# Altium schematic sheet Buttons.SchDoc
size 420 x 297 mm; SheetNumber: 4; SheetTotal: 4
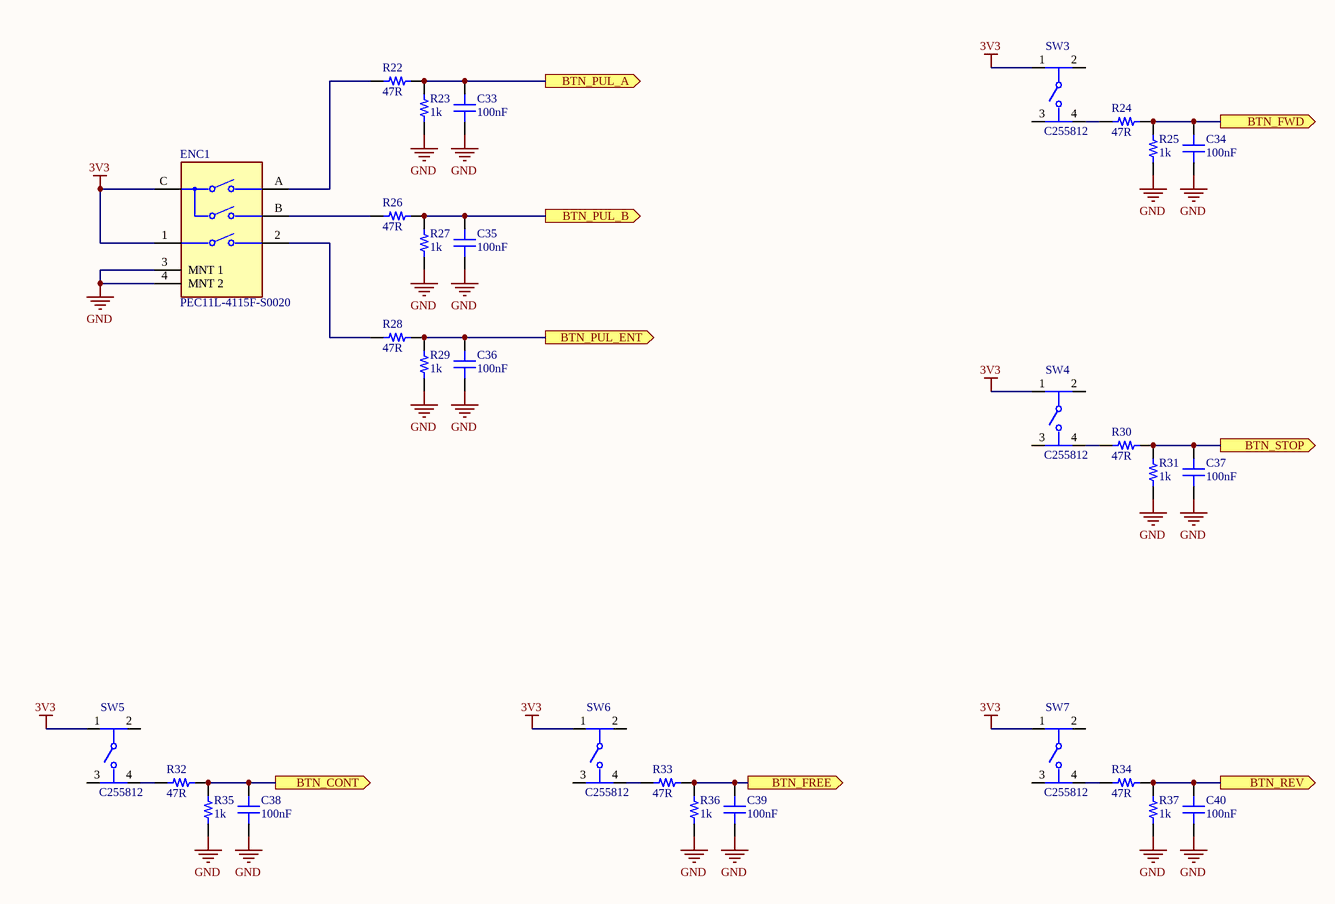
[diagram p0: Buttons.SchDoc]

## Parts
C33  100nF  [CAP 0603_1608]
C34  100nF  [CAP 0603_1608]
C35  100nF  [CAP 0603_1608]
C36  100nF  [CAP 0603_1608]
C37  100nF  [CAP 0603_1608]
C38  100nF  [CAP 0603_1608]
C39  100nF  [CAP 0603_1608]
C40  100nF  [CAP 0603_1608]
ENC1  PEC11L-4115F-S0020  [FP-PEC11L-4115F-S0020-MFG]
R22  47R  [RES 0603_1608]
R23  1k  [RES 0603_1608]
R24  47R  [RES 0603_1608]
R25  1k  [RES 0603_1608]
R26  47R  [RES 0603_1608]
R27  1k  [RES 0603_1608]
R28  47R  [RES 0603_1608]
R29  1k  [RES 0603_1608]
R30  47R  [RES 0603_1608]
R31  1k  [RES 0603_1608]
R32  47R  [RES 0603_1608]
R33  47R  [RES 0603_1608]
R34  47R  [RES 0603_1608]
R35  1k  [RES 0603_1608]
R36  1k  [RES 0603_1608]
R37  1k  [RES 0603_1608]
SW3  C255812  [FP-FSM2JSMAA-MFG]
SW4  C255812  [FP-FSM2JSMAA-MFG]
SW5  C255812  [FP-FSM2JSMAA-MFG]
SW6  C255812  [FP-FSM2JSMAA-MFG]
SW7  C255812  [FP-FSM2JSMAA-MFG]

## Ports
BTN_CONT (out, see ESP32[3A]), BTN_FREE (out, see ESP32[3A]), BTN_FWD (out, see ESP32[3A]), BTN_PUL_A (out, see ESP32[3A]), BTN_PUL_B (out, see ESP32[3A]), BTN_PUL_ENT (out, see ESP32[3A]), BTN_REV (out, see ESP32[3A]), BTN_STOP (out, see ESP32[3A])

## Nets
3V3: ENC1.1 ENC1.C(COMMON) SW3.1 SW4.1 SW5.1 SW6.1 SW7.1
GND: C33.2 C34.2 C35.2 C36.2 C37.2 C38.2 C39.2 C40.2 ENC1.3(MNT_1) ENC1.4(MNT_2) R23.2 R25.2 R27.2 R29.2 R31.2 R35.2 R36.2 R37.2
BTN_CONT: C38.1 R32.2 R35.1 ; port BTN_CONT
BTN_FREE: C39.1 R33.2 R36.1 ; port BTN_FREE
BTN_FWD: C34.1 R24.2 R25.1 ; port BTN_FWD
BTN_PUL_A: C33.1 R22.2 R23.1 ; port BTN_PUL_A
BTN_PUL_B: C35.1 R26.2 R27.1 ; port BTN_PUL_B
BTN_PUL_ENT: C36.1 R28.2 R29.1 ; port BTN_PUL_ENT
BTN_REV: C40.1 R34.2 R37.1 ; port BTN_REV
BTN_STOP: C37.1 R30.2 R31.1 ; port BTN_STOP
NetENC1_2: ENC1.2 R28.1
NetENC1_A: ENC1.A(CHANNEL_A) R22.1
NetENC1_B: ENC1.B(CHANNEL_B) R26.1
NetR24_1: R24.1 SW3.4
NetR30_1: R30.1 SW4.4
NetR32_1: R32.1 SW5.4
NetR33_1: R33.1 SW6.4
NetR34_1: R34.1 SW7.4

Not connected (* = marked no-connect by the designer): SW3 2 3; SW4 2 3; SW5 2 3; SW6 2 3; SW7 2 3

## Notes on the sheet
- This document and the data disclosed herein or herewith is the property
- of MICRONICS and shall not be reproduced or copied without the
- REVISION
- DESCRIPTION
- DATE
- APPROVED
- written permission of MICRONICS ADDITIVE TECHNOLOGY LLC     ©2022
- ENG:
- APPROVALS
- DWG NO.
- micronics
- 1360 Regent St #164
- Madison, WI 53715, USA
- DSN:
- CHK:
- REFERENCE DOCUMENTS
- PROJECT REVISION:
- TITLE
- DOCUMENT REVISION:
- DESIGN ITEM:
- SCALE:
- A3
- SIZE
- CAGE CODE
- FILE NAME
- PROJECT
- SHEET
- OF
- REV
- 1:1

## Library data of the parts
C33-C40 = 250X14W223MV4T: C14663; manufacturer: Johanson Dielectrics Inc.; Temperature Coefficient: X7R; Tolerance: ±20%; Voltage - Rated: 25V; Part Number: 250X14W223MV4T; Value: 100nF; Applications: Bypass, Decoupling; Capacitance: 100nF; componentlink1description: Datasheet; componentlink1url: https://www.johansondielectrics.com/downloads/x2y-filter-and-decoupling-capacitors.pdf; componentlink2description: DigiKey Link; componentlink2url: https://www.digikey.com/en/products/detail/johanson-dielectrics-inc/250X14W223MV4T/1628740; Device Package: 0603 (1608 Metric); Features: Low ESL (X2Y); lastupdated: 2022-05-16 11:25:57 AM; Lifecycle Status: Active; Minimum Order: 1; Mounting Type: Surface Mount, MLCC; Operating Temperature: -55°C ~ 125°C; Package / Case: 0603 (1608 Metric); packaging: TapeAndReel; partid: 14325; Part Status: Active; price: 0.07; series: X2Y®; Size / Dimension: 0.064" L x 0.035" W (1.63mm x 0.89mm); Supplier 1: DigiKey; Supplier Part Number 1: 709-1087-1-ND; Thickness (Max): 0.026" (0.66mm)
ENC1 = CMP-07421-000053-1: ROTARY ENCODER MECHANICAL 20PPR; Output Type: Quadrature; Built in Switch: Yes; Pulses per Revolution: 20; Number of Channels: 2; Series: PEC11; Orientation: Vertical; Packaging: Bulk; Termination: PC Pin; Width: 11.8mm; Detent: Yes; Mount: Through Hole; RoHS Compliant: Yes; Min Operating Temperature: -25°C; Encoder Type: Mechanical; Package Quantity: 75; Max Operating Temperature: 80°C; Length: 19.5mm; Height: 12mm
R22-R37 = RNCF0603DTE23K2: RES 1% 0603; Manufacturer: Stackpole Electronics Inc; Power (Watts): 0.1W, 1/10W; Temperature Coefficient: ±25ppm/°C; Tolerance: ±0.5%; Part Number: RNCF0603DTE23K2; ComponentLink1Description: Datasheet; ComponentLink1URL: https://www.seielect.com/catalog/sei-rncf.pdf; ComponentLink2Description: DigiKey Link; ComponentLink2URL: https://www.digikey.com/en/products/detail/stackpole-electronics-inc/RNCF0603DTE23K2/6264115; Composition: Thin Film; Device Package: 0603 (1608 Metric); Features: Automotive AEC-Q200; Height - Seated (Max): 0.022" (0.55mm); LastUpdated: 2022-05-20 3:01:33 PM; Lifecycle Status: Active; Minimum Order: 1; Number of Terminations: 2; Operating Temperature: -55°C ~ 155°C; Package / Case: 0603 (1608 Metric); Packaging: TapeAndReel; PartId: 5426; Part Status: Active; Price: 0.01; Ratings: AEC-Q200; Series: RNCF; Size / Dimension: 0.061" L x 0.031" W (1.55mm x 0.80mm); Supplier 1: DigiKey; Supplier Part Number 1: RNCF0603DTE23K2CT-ND; Supplier Device Package: 0603
  R22 R24 R26 R28 R30 R32-R34: Value: 47R; Resistance: 47R
  R23 R25 R27 R29 R31 R35-R37: Value: 1k; Resistance: 1k
SW3-SW7 = CMP-03402-000003-1: SWITCH TACTILE SPST-NO 0.05A 24V; Manufacturer Part Number: FSM2JSMAA; Manufacturer: TE Connectivity; Standoff Height: 0.05mm; Contact Current Rating: 50mA; Electromechanical Life: 100000Cycles; Operating Force: 260gf; Contact Resistance: 100mΩ; Package: 0; Temperature Range High: +85°C; Temperature: -35°C to +85°C; Category: Switch; RoHS: TRUE; Mouser Description: Tactile Switches TACTILE 260G FORCE S; Device Class L1: Electromechanical; Mount: Surface Mount; Height: 4.59mm; ComponentLink2URL: https://www.te.com/commerce/DocumentDelivery/DDEController?Action=showdoc&DocId=Customer+Drawing%7F2-1437565-7%7FV%7Fpdf%7FEnglish%7FENG_CD_2-1437565-7_V.pdf%7F2-1437565-8; Temperature Range Low: -35°C; Voltage Rating Dc: 24V; Lead Free: Yes; Automotive: No; Throw Configuration: SPST-NO; Octopart: https://octopart.com/fsm2jsmaa-te+connectivity-41720620; Device Class L2: Switches; Device Class L3: Pushbutton Switches; ComponentLink2Description: Datasheet; Digikey Description: SWITCH TACTILE SPST-NO 0.05A 24V